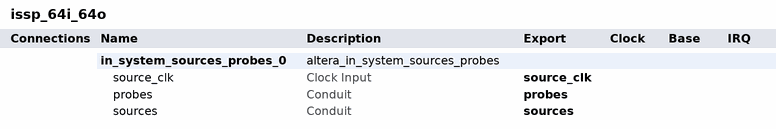
[diagram p0: system contents]
# Platform Designer (Qsys) system issp_64i_64o, Arria V 5AGXMA3D4F27I3
# Parameters at their usual value, and those the tool derives, are not listed.
package require -exact qsys 17.0
create_system issp_64i_64o
set_project_property DEVICE_FAMILY {Arria V}
set_project_property DEVICE 5AGXMA3D4F27I3

add_instance in_system_sources_probes_0 altera_in_system_sources_probes 17.0
set_instance_property in_system_sources_probes_0 AUTO_EXPORT true
set_instance_parameter_value in_system_sources_probes_0 create_source_clock true
set_instance_parameter_value in_system_sources_probes_0 instance_id NONE
set_instance_parameter_value in_system_sources_probes_0 probe_width 64
set_instance_parameter_value in_system_sources_probes_0 source_initial_value 00000000
set_instance_parameter_value in_system_sources_probes_0 source_width 64

# exported interfaces
add_interface probes conduit end
set_interface_property probes EXPORT_OF in_system_sources_probes_0.probes
add_interface source_clk clock sink
set_interface_property source_clk EXPORT_OF in_system_sources_probes_0.source_clk
add_interface sources conduit end
set_interface_property sources EXPORT_OF in_system_sources_probes_0.sources

set_interconnect_requirement {$system} qsys_mm.clockCrossingAdapter HANDSHAKE
set_interconnect_requirement {$system} qsys_mm.enableEccProtection FALSE
set_interconnect_requirement {$system} qsys_mm.insertDefaultSlave FALSE
set_interconnect_requirement {$system} qsys_mm.maxAdditionalLatency 1

save_system issp_64i_64o.qsys
